# Altium project TEST.PrjPcb
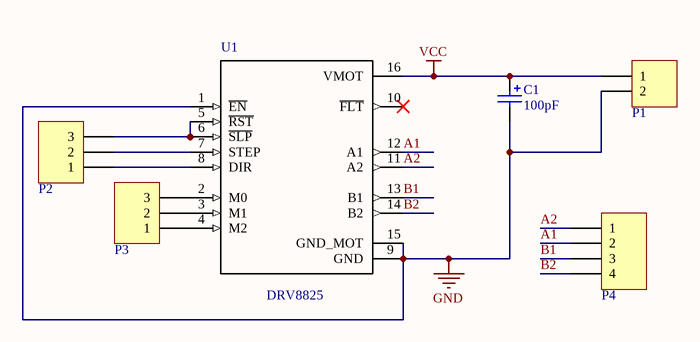
[diagram p0: SCH.SchDoc]
1 sheet, 6 parts. Net scope: global (net labels, ports and power ports of the same name join across sheets).
Board file: PCB.PcbDoc

## Sheet SCH.SchDoc
size A

### Parts
C1  value 100pF  [CP1/2]  (hidden comment: Cap Pol)
P1  Domino 2  [DOMINO 2- 5mm]  (value not drawn)
P2  Header 3  [JP3]  (value not drawn)
P3  Header 3  [JP3]  (value not drawn)
P4  Header 4  [JP4]  (value not drawn)
U1  DRV8825  [*IC_DRV8825_STEPPER_MOTOR_DRIVER_CARRIER]

### Nets
GND: C1.2 P1.2 U1.1(~{EN}) U1.9(GND) U1.15(GND_MOT)
VCC: C1.1 P1.1 U1.16(VMOT)
A1: P4.2 U1.12(A1)
A2: P4.1 U1.11(A2)
B1: P4.3 U1.13(B1)
B2: P4.4 U1.14(B2)
NetP2_1: P2.1 U1.8(DIR)
NetP2_2: P2.2 U1.7(STEP)
NetP2_3: P2.3 U1.5(~{RST}) U1.6(~{SLP})
NetP3_1: P3.1 U1.4(M2)
NetP3_2: P3.2 U1.3(M1)
NetP3_3: P3.3 U1.2(M0)

Not connected (* = marked no-connect by the designer): U1 10(~{FLT})*

### Library data of the parts
C1 = Cap Pol: Polarized Capacitor (Radial)
P1 = Domino 2: Domino, 2-Pin; LatestRevisionDate: 17-Jul-2002; LatestRevisionNote: Re-released for DXP Platform.; Publisher: Altium Limited
P2 P3 = Header 3: Header, 3-Pin; LatestRevisionDate: 17-Jul-2002; LatestRevisionNote: Re-released for DXP Platform.; Publisher: Altium Limited
P4 = Header 4: Header, 4-Pin; LatestRevisionDate: 17-Jul-2002; LatestRevisionNote: Re-released for DXP Platform.; Publisher: Altium Limited
U1 = DRV8825_STEPPER_MOTOR_DRIVER_CARRIER: DRV8825 Motor Controller/Driver Power Management Evaluation Board; MP: DRV8825 STEPPER MOTOR DRIVER CARRIER; MF: Pololu; SnapEDA_Link: https://www.snapeda.com/parts/DRV8825%20STEPPER%20MOTOR%20DRIVER%20CARRIER/Pololu/view-part/1449238/?ref=snap; Availability: Unavailable; Price: None; Package: None; Value: *